# Altium project Shuttler_AMC.PrjPcb (part 9 of 20)

## Sheet I2C_MUX.SchDoc: =ProjectName
size 420 x 297 mm; Author: T.P.; CompanyName: WUT; DrawnBy: T.P.; Organization: WUT ISE; Address1: Warsaw Univeristy of Technology; Address2: Nowowiejska 15/19; DocumentNumber: 34; Revision: 0.9; SheetNumber: 34; SheetTotal: 36; EDA_Number: ARTIQ; Projet: ARTIQ/SINARA; ModifiedBy: -; CreateDate: XX/XX/XXXX; CheckedDate: -; Title2: I2C_MUX.SchDoc; DivGrp: ISE; Designer: G.K. and T.P.; ModifiedDate: -; ProjectName: ADC/DAC MEZZANINE
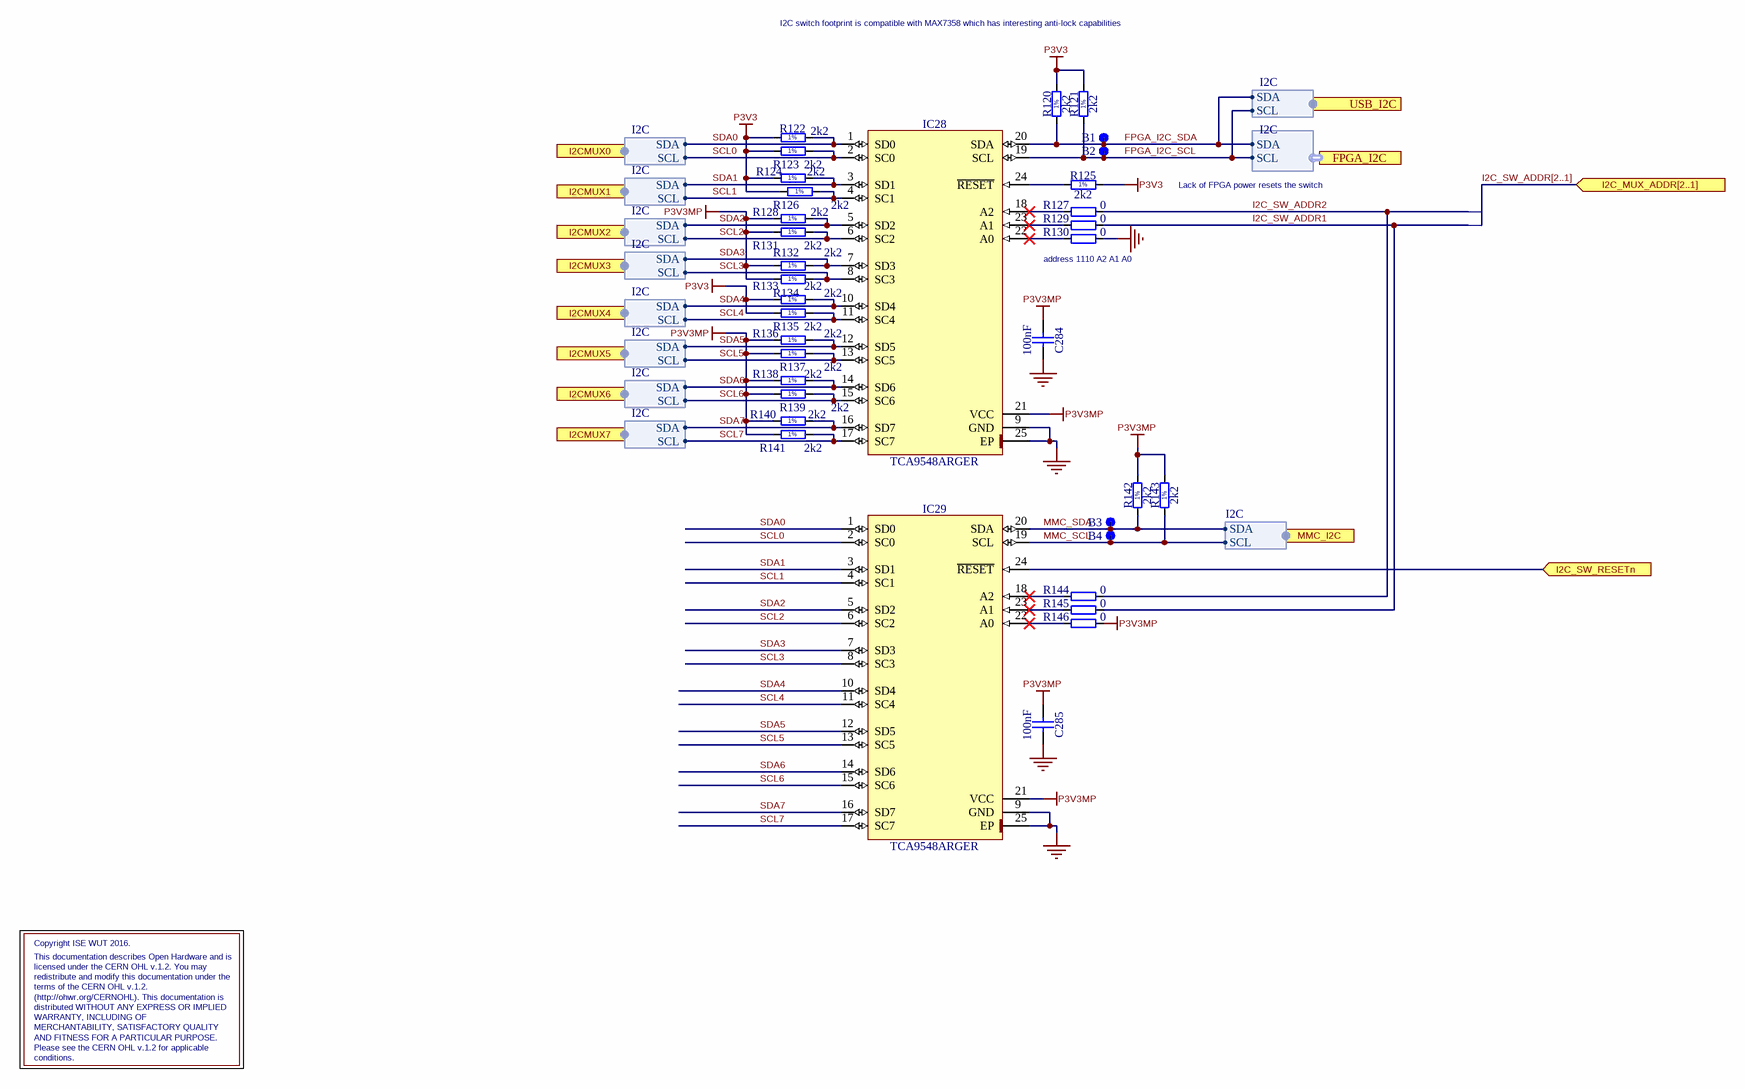
[diagram p16: I2C_MUX.SchDoc]

### Parts
B1  SMD Pad  [C100]  (value not drawn)
B2  SMD Pad  [C100]  (value not drawn)
B3  SMD Pad  [C100]  (value not drawn)
B4  SMD Pad  [C100]  (value not drawn)
C284  100nF  [CAPC0603X33N]
C285  100nF  [CAPC0603X33N]
IC28  TCA9548ARGER  [QFN50P400X400X100-25N-S220]
IC29  TCA9548ARGER  [QFN50P400X400X100-25N-S220]
R120  2k2  [RESC1005X40N]
R121  2k2  [RESC1005X40N]
R122  2k2  [RESC1005X40N]
R123  2k2  [RESC1005X40N]
R124  2k2  [RESC1005X40N]
R125  2k2  [RESC1005X40N]
R126  2k2  [RESC1005X40N]
R127  0  [RESC1005X40N]
R128  2k2  [RESC1005X40N]
R129  0  [RESC1005X40N]
R130  0  [RESC1005X40N]
R131  2k2  [RESC1005X40N]
R132  2k2  [RESC1005X40N]
R133  2k2  [RESC1005X40N]
R134  2k2  [RESC1005X40N]
R135  2k2  [RESC1005X40N]
R136  2k2  [RESC1005X40N]
R137  2k2  [RESC1005X40N]
R138  2k2  [RESC1005X40N]
R139  2k2  [RESC1005X40N]
R140  2k2  [RESC1005X40N]
R141  2k2  [RESC1005X40N]
R142  2k2  [RESC1005X40N]
R143  2k2  [RESC1005X40N]
R144  0  [RESC1005X40N]
R145  0  [RESC1005X40N]
R146  0  [RESC1005X40N]

### Ports
FPGA_I2C (harness I2C), I2C_MUX_ADDR[2..1] (in), I2C_SW_RESETn (in), I2CMUX0 (harness I2C), I2CMUX1 (harness I2C), I2CMUX2 (harness I2C), I2CMUX3 (harness I2C), I2CMUX4 (harness I2C), I2CMUX5 (harness I2C), I2CMUX6 (harness I2C), I2CMUX7 (harness I2C), MMC_I2C (harness I2C), USB_I2C (harness I2C)

### Harnesses
I2C: SCL, SDA

### Nets
GND: C284.2 C285.2 IC28.9(GND) IC28.25(EP) IC29.9(GND) IC29.25(EP) R130.1
P3V3: R120.2 R121.2 R122.1 R123.1 R124.1 R125.1 R126.1 R134.1 R135.1
P3V3MP: C284.1 C285.1 IC28.21(VCC) IC29.21(VCC) R128.1 R131.1 R132.1 R133.1 R136.1 R137.1 R138.1 R139.1 R140.1 R141.1 R142.2 R143.2 R146.1
FPGA_I2C_SCL: B2.1 IC28.19(SCL) R121.1 ; port FPGA_I2C.SCL, port USB_I2C.SCL  [project net FPGA_I2C.SCL]
FPGA_I2C_SDA: B1.1 IC28.20(SDA) R120.1 ; port FPGA_I2C.SDA, port USB_I2C.SDA  [project net FPGA_I2C.SDA]
I2C_SW_ADDR1: R129.1 R145.1  [project net I2C_MUX_ADDR1]
I2C_SW_ADDR2: R127.1 R144.1  [project net I2C_MUX_ADDR2]
I2C_SW_RESETn: IC29.24(~{RESET}) ; port I2C_SW_RESETn
MMC_SCL: B4.1 IC29.19(SCL) R143.1 ; port MMC_I2C.SCL  [project net MMC_I2C.SCL]
MMC_SDA: B3.1 IC29.20(SDA) R142.1 ; port MMC_I2C.SDA  [project net MMC_I2C.SDA]
SCL0: IC28.2(SC0) IC29.2(SC0) R123.2 ; port I2CMUX0.SCL  [project net QSFP0_I2C.SCL]
SCL1: IC28.4(SC1) IC29.4(SC1) R126.2 ; port I2CMUX1.SCL  [project net QSFP1_I2C.SCL]
SCL2: IC28.6(SC2) IC29.6(SC2) R131.2 ; port I2CMUX2.SCL  [project net DAC_I2C.SCL]
SCL3: IC28.8(SC3) IC29.8(SC3) R133.2 ; port I2CMUX3.SCL
SCL4: IC28.11(SC4) IC29.11(SC4) R135.2 ; port I2CMUX4.SCL  [project net SI5324_I2C.SCL]
SCL5: IC28.13(SC5) IC29.13(SC5) R137.2 ; port I2CMUX5.SCL  [project net PM_I2C.SCL]
SCL6: IC28.15(SC6) IC29.15(SC6) R139.2 ; port I2CMUX6.SCL  [project net SENS_I2C.SCL]
SCL7: IC28.17(SC7) IC29.17(SC7) R141.2 ; port I2CMUX7.SCL
SDA0: IC28.1(SD0) IC29.1(SD0) R122.2 ; port I2CMUX0.SDA  [project net QSFP0_I2C.SDA]
SDA1: IC28.3(SD1) IC29.3(SD1) R124.2 ; port I2CMUX1.SDA  [project net QSFP1_I2C.SDA]
SDA2: IC28.5(SD2) IC29.5(SD2) R128.2 ; port I2CMUX2.SDA  [project net DAC_I2C.SDA]
SDA3: IC28.7(SD3) IC29.7(SD3) R132.2 ; port I2CMUX3.SDA
SDA4: IC28.10(SD4) IC29.10(SD4) R134.2 ; port I2CMUX4.SDA  [project net SI5324_I2C.SDA]
SDA5: IC28.12(SD5) IC29.12(SD5) R136.2 ; port I2CMUX5.SDA  [project net PM_I2C.SDA]
SDA6: IC28.14(SD6) IC29.14(SD6) R138.2 ; port I2CMUX6.SDA  [project net SENS_I2C.SDA]
SDA7: IC28.16(SD7) IC29.16(SD7) R140.2 ; port I2CMUX7.SDA
NetIC28_18: IC28.18(A2) R127.2
NetIC28_22: IC28.22(A0) R130.2
NetIC28_23: IC28.23(A1) R129.2
NetIC28_24: IC28.24(~{RESET}) R125.2
NetIC29_18: IC29.18(A2) R144.2
NetIC29_22: IC29.22(A0) R146.2
NetIC29_23: IC29.23(A1) R145.2

### Buses and harness runs
bus I2C_SW_ADDR[2..1] = port I2C_MUX_ADDR[2..1]

### Notes on the sheet
- I2C switch footprint is compatible with MAX7358 which has interesting anti-lock capabilities
- Lack of FPGA power resets the switch
- (near R130) address 1110 A2 A1 A0
- Copyright ISE WUT 2016.
- This documentation describes Open Hardware and is
- licensed under the CERN OHL v.1.2. You may
- distributed WITHOUT ANY EXPRESS OR IMPLIED
- terms of the CERN OHL v.1.2.
- WARRANTY, INCLUDING OF
- redistribute and modify this documentation under the
- (http://ohwr.org/CERNOHL). This documentation is
- MERCHANTABILITY, SATISFACTORY QUALITY
- conditions.
- Please see the CERN OHL v.1.2 for applicable
- AND FITNESS FOR A PARTICULAR PURPOSE.
- Project/Equipment
- Document
- Designer
- Drawn by
- Check.by
- File
- Last Mod.
- Print Date
- Sheet
- Size
- A3
- of
- Rev
- (in symbol R0402_2K2_1%_0.0625W_100PPM) 1%

### Library data of the parts
B1-B4 = SMD_PAD_D1MM: Through Hole Pad; Part Description: 1mm Diameter SMD Pad; Mounted: No; Part Number: SMD_PAD_D1MM; Component Kind: Standard (No BOM); Component Type: Standard (No BOM); Pin Count: 1; Family: SMD Pad; Socket: No; SMD: No; Sense: No; Status: None; ComponentHeight: 0mm; HelpURL: Undefined; Author: CERN DEM JLC; CreateDate: 10.10.2017; LatestRevisionDate: 10.10.2017; PackageDescription: 1mm Diameter SMD Pad
C284 C285 = CC0201_100NF_6.3V_10%_X5R: as C158 on sheet Clk_recovery; Manufacturer Part Number: CC0201_100NF_6.3V_10%_X5R; Part Number: CC0201_100NF_6.3V_10%_X5R; Value: 100nF; Component Kind: Standard; Component Type: Standard; Pin Count: 2; Status: Not Recommended; Case: 0201; Mounted: Yes; Socket: No; SMD: Yes; Sense: No; Manufacturer1 Example: AVX; Manufacturer1 ComponentHeight: 0.33mm; HelpURL: \\cern.ch\dfs\Applications\Altium\Datasheets\CC0201_X5R_AVX.pdf; Author: CERN DEM JLC; CreateDate: 03.12.2007; LatestRevisionDate: 03.12.2007
IC28 IC29 = TCA9548ARGER: Low Voltage 8-Channel I2C Switch With Reset; Manufacturer: TEXAS INSTRUMENTS; PressFit: No; Bonding: No; Manufacturer Part Number: TCA9548ARGER; PackageDescription: QFN, 0.50mm Pitch, Square; 24 Pin, 4.00mm L X 4.00mm W X 1.00mm H body (w/thermal tab 2.2 X 2.2mm), IPC Medium Density; Part Description: Low Voltage 8-Channel I2C Switch With Reset; Part Number: TCA9548ARGER; Component Kind: Standard; Component Type: Standard; Device: TCA9548ARGER; Pin Count: 25; Case: QFN24; Mounted: Yes; Socket: No; SMD: Yes; Sense: No; ComponentHeight: 1mm; Author: CERN DEM JLC; HelpURL: \\cern.ch\dfs\Applications\Altium\Datasheets\TCA9548ARGER.pdf; CreateDate: 07.07.2014; LatestRevisionDate: 07.07.2014
R120-R126 R128 R131-R143 = R0402_2K2_1%_0.0625W_100PPM: Resistor - 1%; Manufacturer: GENERIC; Part Description: General Purpose Thick Film Chip Resistor; Manufacturer1 Part Number: 232270672202L; TC: ±100ppm/°C; PressFit: No; Manufacturer Part Number: R0402_2K2_1%_0.0625W_100PPM; Part Number: R0402_2K2_1%_0.0625W_100PPM; Tolerance: ±1%; Value: 2k2; Component Kind: Standard; Component Type: Standard; Pin Count: 2; Status: Not Recommended; Power: 0.0625W; Case: 0402; Mounted: Yes; Sense: No; Socket: No; SMD: Yes; Manufacturer1 Example: YAGEO PHYCOMP; Manufacturer1 ComponentHeight: 0.4mm; HelpURL: \\cern.ch\dfs\Applications\Altium\Datasheets\R0402_Phycomp_RC0402.pdf; Author: CERN DEM JLC; CreateDate: 03.12.2007; LatestRevisionDate: 17.10.2012
R127 R129 R130 R144-R146 = R0402_0R_JUMPER: as R389 on sheet Clk_recovery; Manufacturer Part Number: R0402_0R_JUMPER; Part Number: R0402_0R_JUMPER; Value: 0; Component Kind: Standard; Component Type: Standard; Pin Count: 2; Status: Not Recommended; Case: 0402; Mounted: Yes; Sense: No; Socket: No; SMD: Yes; Manufacturer1 Example: YAGEO PHYCOMP; Manufacturer1 ComponentHeight: 0.4mm; HelpURL: \\cern.ch\dfs\Applications\Altium\Datasheets\R0402_Phycomp_RC0402.pdf; Author: CERN DEM JLC; CreateDate: 03.12.2007; LatestRevisionDate: 17.10.2012

## Sheet M-LVDS_PHY.SchDoc: =ProjectName
size 420 x 297 mm; Author: T.P.; CompanyName: WUT; DrawnBy: T.P.; Organization: WUT ISE; Address1: Warsaw Univeristy of Technology; Address2: Nowowiejska 15/19; DocumentNumber: 32; Revision: 0.9; SheetNumber: 32; SheetTotal: 36; EDA_Number: ARTIQ; Projet: ARTIQ/SINARA; ModifiedBy: -; CreateDate: XX/XX/XXXX; CheckedDate: -; Title2: M-LVDS_PHY.SchDoc; DivGrp: ISE; Designer: G.K. and T.P.; ModifiedDate: -; ProjectName: ADC/DAC MEZZANINE
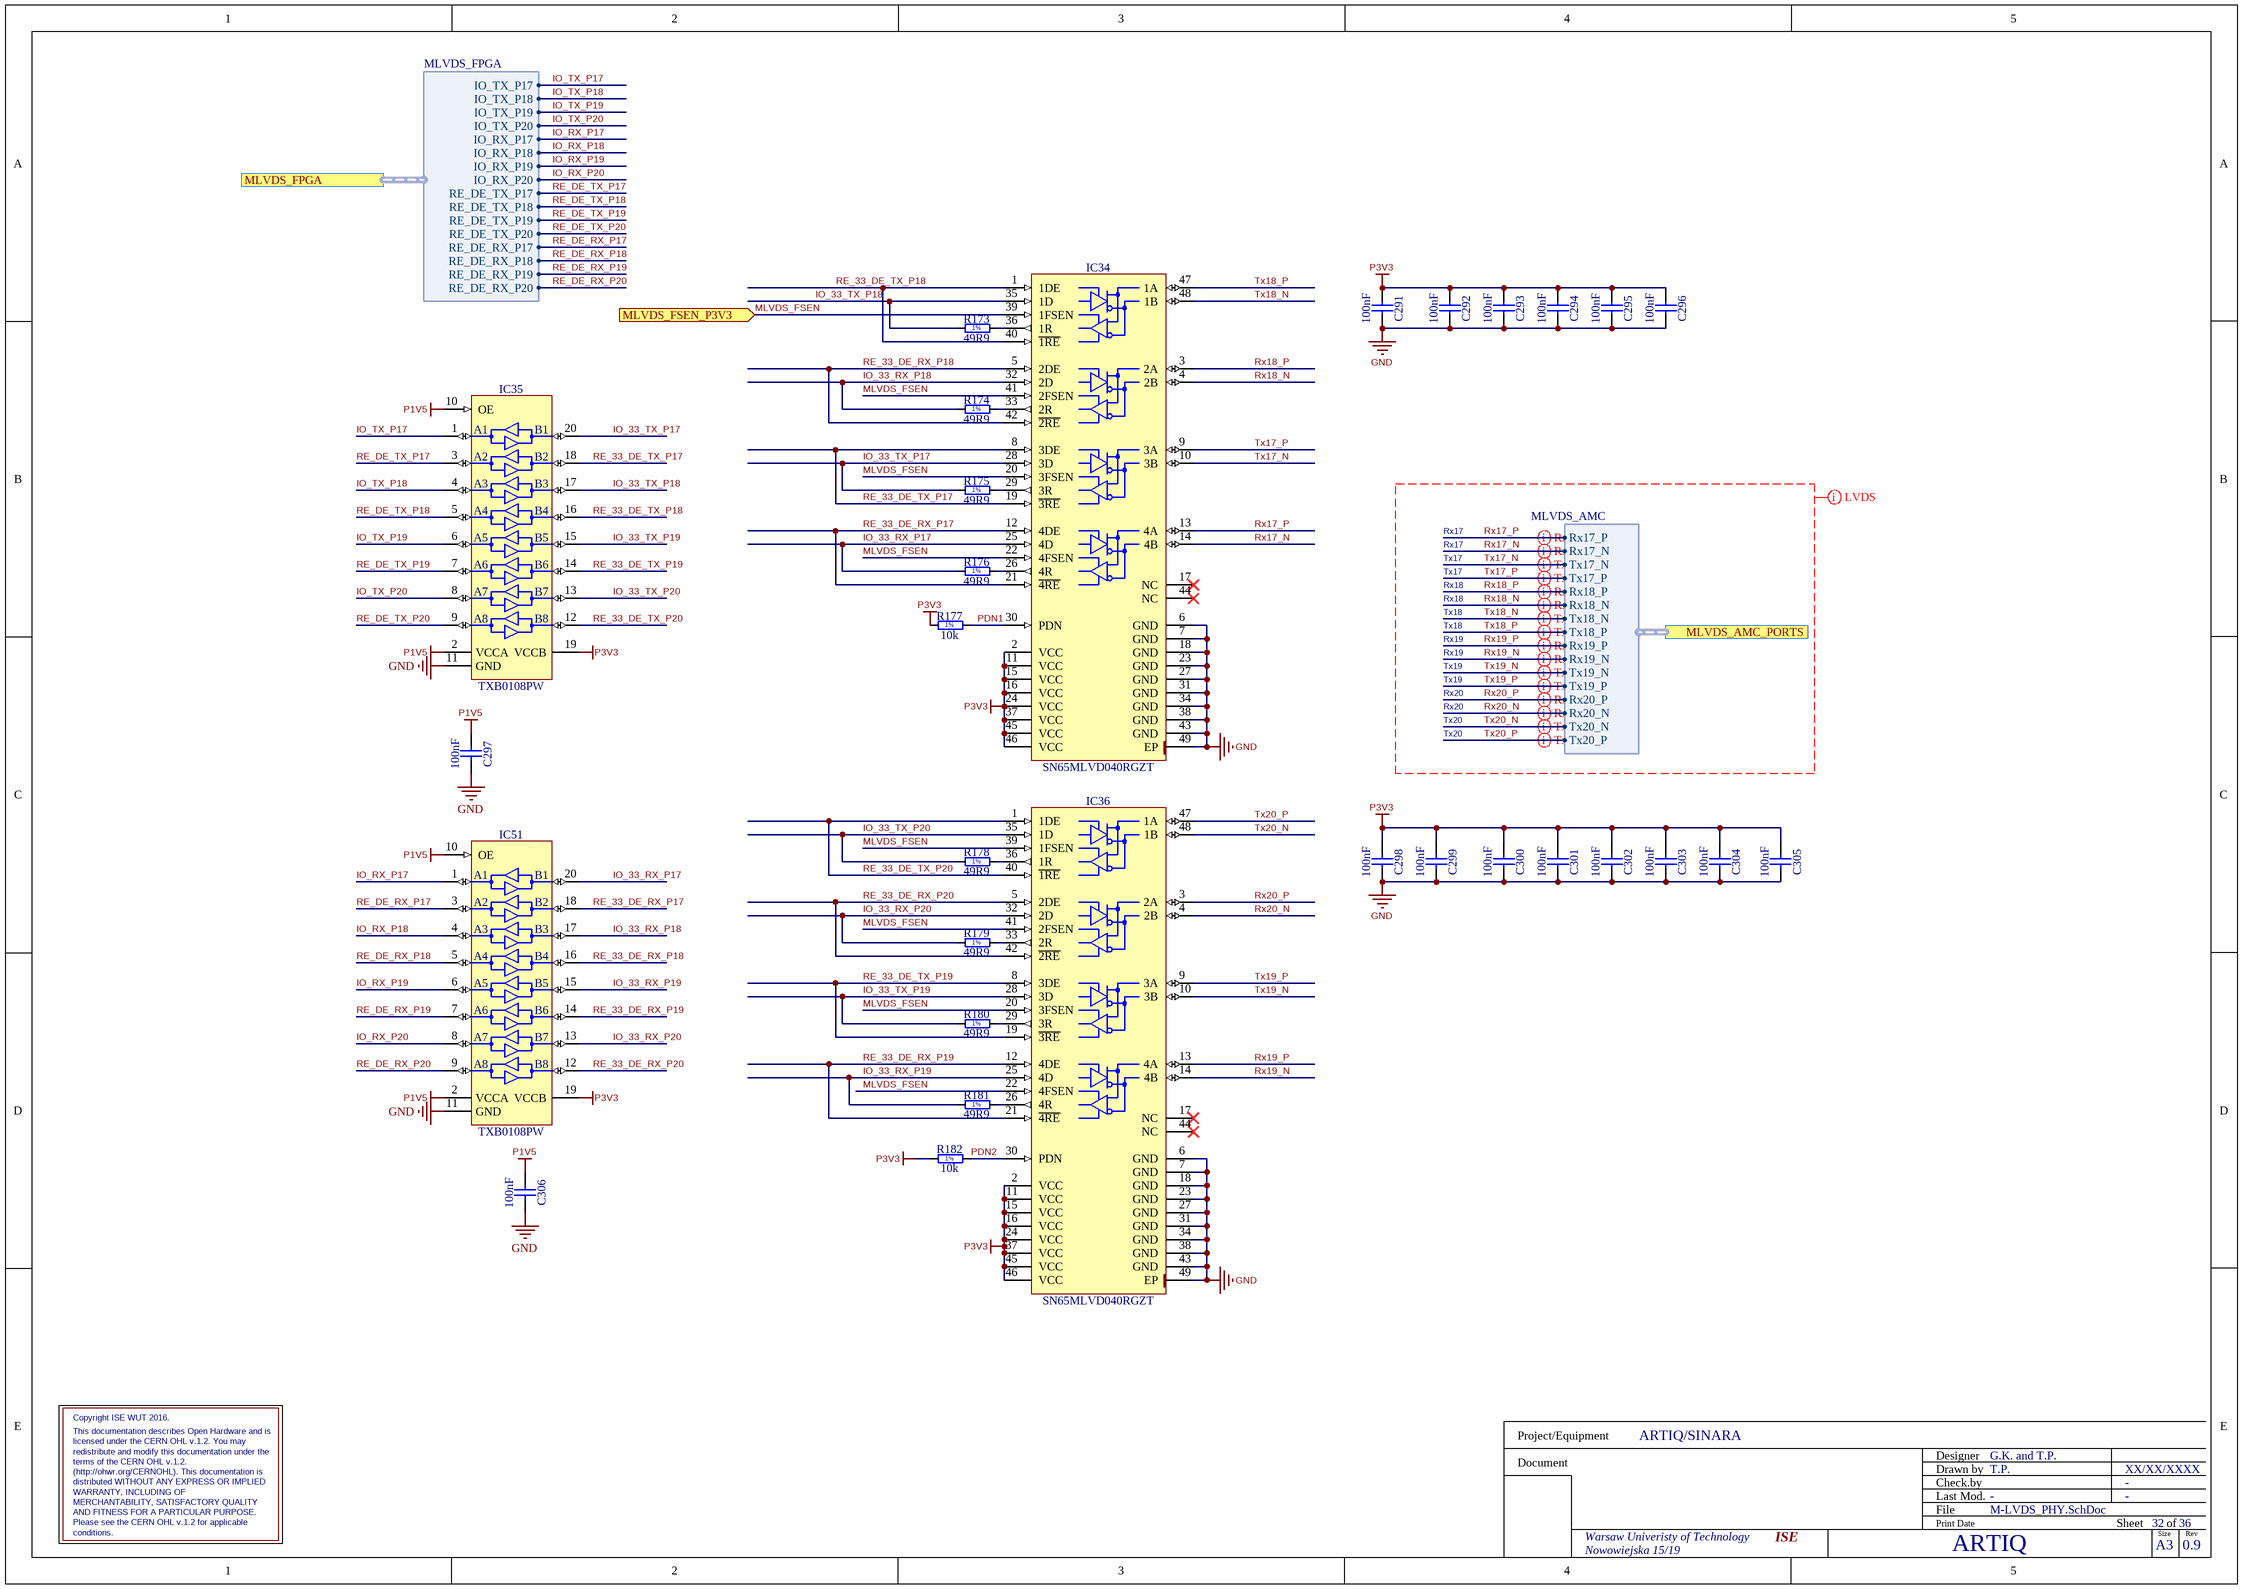
[diagram p17: M-LVDS_PHY.SchDoc]

### Parts
C291  100nF  [CAPC0603X33N]
C292  100nF  [CAPC0603X33N]
C293  100nF  [CAPC0603X33N]
C294  100nF  [CAPC0603X33N]
C295  100nF  [CAPC0603X33N]
C296  100nF  [CAPC0603X33N]
C297  100nF  [CAPC0603X33N]
C298  100nF  [CAPC0603X33N]
C299  100nF  [CAPC0603X33N]
C300  100nF  [CAPC0603X33N]
C301  100nF  [CAPC0603X33N]
C302  100nF  [CAPC0603X33N]
C303  100nF  [CAPC0603X33N]
C304  100nF  [CAPC0603X33N]
C305  100nF  [CAPC0603X33N]
C306  100nF  [CAPC0603X33N]
IC34  SN65MLVD040RGZT  [QFN50P700X700X100-49N-S420]
IC35  TXB0108PW  [SOP65P640X120-20N]
IC36  SN65MLVD040RGZT  [QFN50P700X700X100-49N-S420]
IC51  TXB0108PW  [SOP65P640X120-20N]
R173  49R9  [RESC1005X40N]
R174  49R9  [RESC1005X40N]
R175  49R9  [RESC1005X40N]
R176  49R9  [RESC1005X40N]
R177  10k  [RESC1005X40N]
R178  49R9  [RESC1005X40N]
R179  49R9  [RESC1005X40N]
R180  49R9  [RESC1005X40N]
R181  49R9  [RESC1005X40N]
R182  10k  [RESC1005X40N]

### Ports
MLVDS_AMC_PORTS (harness MLVDS_AMC), MLVDS_FPGA (harness MLVDS_FPGA), MLVDS_FSEN_P3V3 (in)

### Harnesses
MLVDS_AMC: Rx17_P, Rx17_N, Tx17_N, Tx17_P, Rx18_P, Rx18_N, Tx18_N, Tx18_P, Rx19_P, Rx19_N, Tx19_N, Tx19_P, Rx20_P, Rx20_N, Tx20_N, Tx20_P
MLVDS_FPGA: IO_TX_P17, IO_TX_P18, IO_TX_P19, IO_TX_P20, IO_RX_P17, IO_RX_P18, IO_RX_P19, IO_RX_P20, RE_DE_TX_P17, RE_DE_TX_P18, RE_DE_TX_P19, RE_DE_TX_P20, RE_DE_RX_P17, RE_DE_RX_P18, RE_DE_RX_P19, RE_DE_RX_P20

### Nets
GND: C291.2 C292.2 C293.2 C294.2 C295.2 C296.2 C297.2 C298.2 C299.2 C300.2 C301.2 C302.2 C303.2 C304.2 C305.2 C306.2 IC34.6(GND) IC34.7(GND) IC34.18(GND) IC34.23(GND) IC34.27(GND) IC34.31(GND) IC34.34(GND) IC34.38(GND) IC34.43(GND) IC34.49(EP) IC35.11(GND) IC36.6(GND) IC36.7(GND) IC36.18(GND) IC36.23(GND) IC36.27(GND) IC36.31(GND) IC36.34(GND) IC36.38(GND) IC36.43(GND) IC36.49(EP) IC51.11(GND)
P1V5: C297.1 C306.1 IC35.2(Vcca) IC35.10(OE) IC51.2(Vcca) IC51.10(OE)
P3V3: C291.1 C292.1 C293.1 C294.1 C295.1 C296.1 C298.1 C299.1 C300.1 C301.1 C302.1 C303.1 C304.1 C305.1 IC34.2(VCC) IC34.11(VCC) IC34.15(VCC) IC34.16(VCC) IC34.24(VCC) IC34.37(VCC) IC34.45(VCC) IC34.46(VCC) IC35.19(Vccb) IC36.2(VCC) IC36.11(VCC) IC36.15(VCC) IC36.16(VCC) IC36.24(VCC) IC36.37(VCC) IC36.45(VCC) IC36.46(VCC) IC51.19(Vccb) R177.1 R182.1
IO_33_RX_P17: IC34.25(4D) IC51.20(B1) R176.1
IO_33_RX_P18: IC34.32(2D) IC51.17(B3) R174.1
IO_33_RX_P19: IC36.25(4D) IC51.15(B5) R181.1
IO_33_RX_P20: IC36.32(2D) IC51.13(B7) R179.1
IO_33_TX_P17: IC34.28(3D) IC35.20(B1) R175.1
IO_33_TX_P18: IC34.35(1D) IC35.17(B3) R173.1
IO_33_TX_P19: IC35.15(B5) IC36.28(3D) R180.1
IO_33_TX_P20: IC35.13(B7) IC36.35(1D) R178.1
IO_RX_P17: IC51.1(A1) ; port MLVDS_FPGA.IO_RX_P17
IO_RX_P18: IC51.4(A3) ; port MLVDS_FPGA.IO_RX_P18
IO_RX_P19: IC51.6(A5) ; port MLVDS_FPGA.IO_RX_P19
IO_RX_P20: IC51.8(A7) ; port MLVDS_FPGA.IO_RX_P20
IO_TX_P17: IC35.1(A1) ; port MLVDS_FPGA.IO_TX_P17
IO_TX_P18: IC35.4(A3) ; port MLVDS_FPGA.IO_TX_P18
IO_TX_P19: IC35.6(A5) ; port MLVDS_FPGA.IO_TX_P19
IO_TX_P20: IC35.8(A7) ; port MLVDS_FPGA.IO_TX_P20
MLVDS_FSEN: IC34.20(3FSEN) IC34.22(4FSEN) IC34.39(1FSEN) IC34.41(2FSEN) IC36.20(3FSEN) IC36.22(4FSEN) IC36.39(1FSEN) IC36.41(2FSEN) ; port MLVDS_FSEN_P3V3
PDN1: IC34.30(PDN) R177.2
PDN2: IC36.30(PDN) R182.2
RE_33_DE_RX_P17: IC34.12(4DE) IC34.21(~{4RE}) IC51.18(B2)
RE_33_DE_RX_P18: IC34.5(2DE) IC34.42(~{2RE}) IC51.16(B4)
RE_33_DE_RX_P19: IC36.12(4DE) IC36.21(~{4RE}) IC51.14(B6)
RE_33_DE_RX_P20: IC36.5(2DE) IC36.42(~{2RE}) IC51.12(B8)
RE_33_DE_TX_P17: IC34.8(3DE) IC34.19(~{3RE}) IC35.18(B2)
RE_33_DE_TX_P18: IC34.1(1DE) IC34.40(~{1RE}) IC35.16(B4)
RE_33_DE_TX_P19: IC35.14(B6) IC36.8(3DE) IC36.19(~{3RE})
RE_33_DE_TX_P20: IC35.12(B8) IC36.1(1DE) IC36.40(~{1RE})
RE_DE_RX_P17: IC51.3(A2) ; port MLVDS_FPGA.RE_DE_RX_P17
RE_DE_RX_P18: IC51.5(A4) ; port MLVDS_FPGA.RE_DE_RX_P18
RE_DE_RX_P19: IC51.7(A6) ; port MLVDS_FPGA.RE_DE_RX_P19
RE_DE_RX_P20: IC51.9(A8) ; port MLVDS_FPGA.RE_DE_RX_P20
RE_DE_TX_P17: IC35.3(A2) ; port MLVDS_FPGA.RE_DE_TX_P17
RE_DE_TX_P18: IC35.5(A4) ; port MLVDS_FPGA.RE_DE_TX_P18
RE_DE_TX_P19: IC35.7(A6) ; port MLVDS_FPGA.RE_DE_TX_P19
RE_DE_TX_P20: IC35.9(A8) ; port MLVDS_FPGA.RE_DE_TX_P20
Rx17_N: IC34.14(4B) ; port MLVDS_AMC_PORTS.Rx17_N  [project net MLVDS_AMC_PORTS.Rx17_N]
Rx17_P: IC34.13(4A) ; port MLVDS_AMC_PORTS.Rx17_P  [project net MLVDS_AMC_PORTS.Rx17_P]
Rx18_N: IC34.4(2B) ; port MLVDS_AMC_PORTS.Rx18_N  [project net MLVDS_AMC_PORTS.Rx18_N]
Rx18_P: IC34.3(2A) ; port MLVDS_AMC_PORTS.Rx18_P  [project net MLVDS_AMC_PORTS.Rx18_P]
Rx19_N: IC36.14(4B) ; port MLVDS_AMC_PORTS.Rx19_N  [project net MLVDS_AMC_PORTS.Rx19_N]
Rx19_P: IC36.13(4A) ; port MLVDS_AMC_PORTS.Rx19_P  [project net MLVDS_AMC_PORTS.Rx19_P]
Rx20_N: IC36.4(2B) ; port MLVDS_AMC_PORTS.Rx20_N  [project net MLVDS_AMC_PORTS.Rx20_N]
Rx20_P: IC36.3(2A) ; port MLVDS_AMC_PORTS.Rx20_P  [project net MLVDS_AMC_PORTS.Rx20_P]
Tx17_N: IC34.10(3B) ; port MLVDS_AMC_PORTS.Tx17_N  [project net MLVDS_AMC_PORTS.Tx17_N]
Tx17_P: IC34.9(3A) ; port MLVDS_AMC_PORTS.Tx17_P  [project net MLVDS_AMC_PORTS.Tx17_P]
Tx18_N: IC34.48(1B) ; port MLVDS_AMC_PORTS.Tx18_N  [project net MLVDS_AMC_PORTS.Tx18_N]
Tx18_P: IC34.47(1A) ; port MLVDS_AMC_PORTS.Tx18_P  [project net MLVDS_AMC_PORTS.Tx18_P]
Tx19_N: IC36.10(3B) ; port MLVDS_AMC_PORTS.Tx19_N  [project net MLVDS_AMC_PORTS.Tx19_N]
Tx19_P: IC36.9(3A) ; port MLVDS_AMC_PORTS.Tx19_P  [project net MLVDS_AMC_PORTS.Tx19_P]
Tx20_N: IC36.48(1B) ; port MLVDS_AMC_PORTS.Tx20_N  [project net MLVDS_AMC_PORTS.Tx20_N]
Tx20_P: IC36.47(1A) ; port MLVDS_AMC_PORTS.Tx20_P  [project net MLVDS_AMC_PORTS.Tx20_P]
NetIC34_26: IC34.26(4R) R176.2
NetIC34_29: IC34.29(3R) R175.2
NetIC34_33: IC34.33(2R) R174.2
NetIC34_36: IC34.36(1R) R173.2
NetIC36_26: IC36.26(4R) R181.2
NetIC36_29: IC36.29(3R) R180.2
NetIC36_33: IC36.33(2R) R179.2
NetIC36_36: IC36.36(1R) R178.2

Not connected (* = marked no-connect by the designer): IC34 17(NC)* 44(NC)*; IC36 17(NC)* 44(NC)*

### Layout directives
differential pair: MLVDS_AMC_PORTS.Rx17_N, MLVDS_AMC_PORTS.Rx17_P, MLVDS_AMC_PORTS.Rx18_N, MLVDS_AMC_PORTS.Rx18_P, MLVDS_AMC_PORTS.Rx19_N, MLVDS_AMC_PORTS.Rx19_P, MLVDS_AMC_PORTS.Rx20_N, MLVDS_AMC_PORTS.Rx20_P, MLVDS_AMC_PORTS.Tx17_N, MLVDS_AMC_PORTS.Tx17_P, MLVDS_AMC_PORTS.Tx18_N, MLVDS_AMC_PORTS.Tx18_P, MLVDS_AMC_PORTS.Tx19_N, MLVDS_AMC_PORTS.Tx19_P, MLVDS_AMC_PORTS.Tx20_N, MLVDS_AMC_PORTS.Tx20_P
mark named LVDS: Rx17_N, Rx17_P, Rx18_N, Rx18_P, Rx19_N, Rx19_P, Rx20_N, Rx20_P, Tx17_N, Tx17_P, Tx18_N, Tx18_P, Tx19_N, Tx19_P, Tx20_N, Tx20_P

### Notes on the sheet
- Rx17
- Tx17
- Rx18
- Tx19
- Tx18
- Rx19
- Tx20
- Rx20
- Copyright ISE WUT 2016.
- distributed WITHOUT ANY EXPRESS OR IMPLIED
- (http://ohwr.org/CERNOHL). This documentation is
- redistribute and modify this documentation under the
- terms of the CERN OHL v.1.2.
- licensed under the CERN OHL v.1.2. You may
- This documentation describes Open Hardware and is
- AND FITNESS FOR A PARTICULAR PURPOSE.
- MERCHANTABILITY, SATISFACTORY QUALITY
- Please see the CERN OHL v.1.2 for applicable
- conditions.
- WARRANTY, INCLUDING OF
- Project/Equipment
- Document
- Designer
- Drawn by
- Check.by
- File
- Last Mod.
- Print Date
- Sheet
- Size
- A3
- of
- Rev
- (in symbol R0402_10K_1%_0.0625W_100PPM) 1%
- (in symbol R0402_49R9_1%_0.0625W_100PPM) 1%
- (in symbol TXB0108PW) VCCA; VCCB

### Library data of the parts
C291-C306 = CC0201_100NF_6.3V_10%_X5R: Non-polarised capacitor; Manufacturer: GENERIC; Manufacturer1 Part Number: 02016D104KAT2A; Part Description: SMD Multilayer Chip Ceramic Capacitor; TC: X5R; Tolerance: ±10%; Voltage: 6.3V; Author: CERN DEM JLC; Case: 0201; Component Kind: Standard; Component Type: Standard; CreateDate: 03.12.2007; HelpURL: \\cern.ch\dfs\Applications\Altium\Datasheets\CC0201_X5R_AVX.pdf; LatestRevisionDate: 03.12.2007; Manufacturer Part Number: CC0201_100NF_6.3V_10%_X5R; Manufacturer1 ComponentHeight: 0.33mm; Manufacturer1 Example: AVX; Mounted: Yes; Part Number: CC0201_100NF_6.3V_10%_X5R; Pin Count: 2; SMD: Yes; Socket: No; Status: Not Recommended; Value: 100nF; Sense: No
IC34 IC36 = SN65MLVD040RGZT: 4-Channel Half-Duplex M-LVDS Line Transceiver; Manufacturer: TEXAS INSTRUMENTS; PressFit: No; Bonding: No; Part Number: SN65MLVD040RGZT; Component Kind: Standard; Component Type: Standard; Device: SN65MLVD040RGZT; PackageDescription: QFN, 0.50mm Pitch, Square; 48 Pin, 7.00mm L X 7.00mm W X 1mm H body (W/Thermal Tab 4.2mm X 4.2mm), IPC Medium Density; Part Description: 4-Channel Half-Duplex M-LVDS Line Transceiver; Manufacturer Part Number: SN65MLVD040RGZT; Pin Count: 49; Case: QFN48; Mounted: Yes; Socket: No; SMD: Yes; Sense: No; ComponentHeight: 1mm; Author: CERN DEM JLC; HelpURL: \\cern.ch\dfs\Applications\Altium\Datasheets\SN65MLVD040RGZT.pdf; CreateDate: 17.03.2011; LatestRevisionDate: 17.03.2011
IC35 IC51 = TXB0108PW: 8-Bit Bidirectional Voltage-Level Translator with Automatic Direction Sensing and ±15kV ESD Protection; Manufacturer: TEXAS INSTRUMENTS; PressFit: No; Bonding: No; Part Number: TXB0108PW; Component Kind: Standard; Component Type: Standard; Device: TXB0108PW; PackageDescription: SOP, 20-Leads, Body 6.5x4.4mm, Pitch 0.65mm, IPC Medium Density; Part Description: 8-Bit Bidirectional Voltage-Level Translator with Automatic Direction Sensing and ±15kV ESD Protection; Manufacturer Part Number: TXB0108PW; Pin Count: 20; Case: TSSOP20; Mounted: Yes; Socket: No; SMD: Yes; Sense: No; ComponentHeight: 1.2mm; Author: CERN DEM MR; HelpURL: \\cern.ch\dfs\Applications\Altium\Datasheets\TXB0108PW.pdf; CreateDate: 01.04.2016; LatestRevisionDate: 01.04.2016
R173-R176 R178-R181 = R0402_49R9_1%_0.0625W_100PPM: Resistor - 1%; Manufacturer: GENERIC; Manufacturer1 Part Number: 232270674999L or RC0402FR-0749R9L; Part Description: General Purpose Thick Film Chip Resistor; TC: ±100ppm/°C; PressFit: No; Author: CERN DEM JLC; Case: 0402; Component Kind: Standard; Component Type: Standard; CreateDate: 24.10.2012; HelpURL: \\cern.ch\dfs\Applications\Altium\Datasheets\R0402_Phycomp_RC0402.pdf; LatestRevisionDate: 24.10.2012; Manufacturer Part Number: R0402_49R9_1%_0.0625W_100PPM; Manufacturer1 ComponentHeight: 0.4mm; Manufacturer1 Example: YAGEO PHYCOMP; Mounted: Yes; Part Number: R0402_49R9_1%_0.0625W_100PPM; Pin Count: 2; Power: 0.0625W; SMD: Yes; Socket: No; Status: Not Recommended; Tolerance: ±1%; Value: 49R9; Sense: No
R177 R182 = R0402_10K_1%_0.0625W_100PPM: Resistor - 1%; Manufacturer: GENERIC; Manufacturer1 Part Number: 232270671003L; Part Description: General Purpose Thick Film Chip Resistor; TC: ±100ppm/°C; PressFit: No; Author: CERN DEM JLC; Case: 0402; Component Kind: Standard; Component Type: Standard; CreateDate: 03.12.2007; HelpURL: \\cern.ch\dfs\Applications\Altium\Datasheets\R0402_Phycomp_RC0402.pdf; LatestRevisionDate: 17.10.2012; Manufacturer Part Number: R0402_10K_1%_0.0625W_100PPM; Manufacturer1 ComponentHeight: 0.4mm; Manufacturer1 Example: YAGEO PHYCOMP; Mounted: Yes; Part Number: R0402_10K_1%_0.0625W_100PPM; Pin Count: 2; Power: 0.0625W; SMD: Yes; Socket: No; Status: Not Recommended; Tolerance: ±1%; Value: 10k; Sense: No

## Sheet Thermometers.SchDoc: =ProjectName
size 420 x 297 mm; Author: T.P.; CompanyName: WUT; DrawnBy: T.P.; Organization: WUT ISE; Address1: Warsaw Univeristy of Technology; Address2: Nowowiejska 15/19; DocumentNumber: 22; Revision: 0.9; SheetNumber: 22; SheetTotal: 36; EDA_Number: ARTIQ; Projet: ARTIQ/SINARA; ModifiedBy: -; CreateDate: XX/XX/XXXX; CheckedDate: -; Title2: Thermometers.SchDoc; DivGrp: ISE; Designer: G.K. and T.P.; ModifiedDate: -; ProjectName: ADC/DAC MEZZANINE
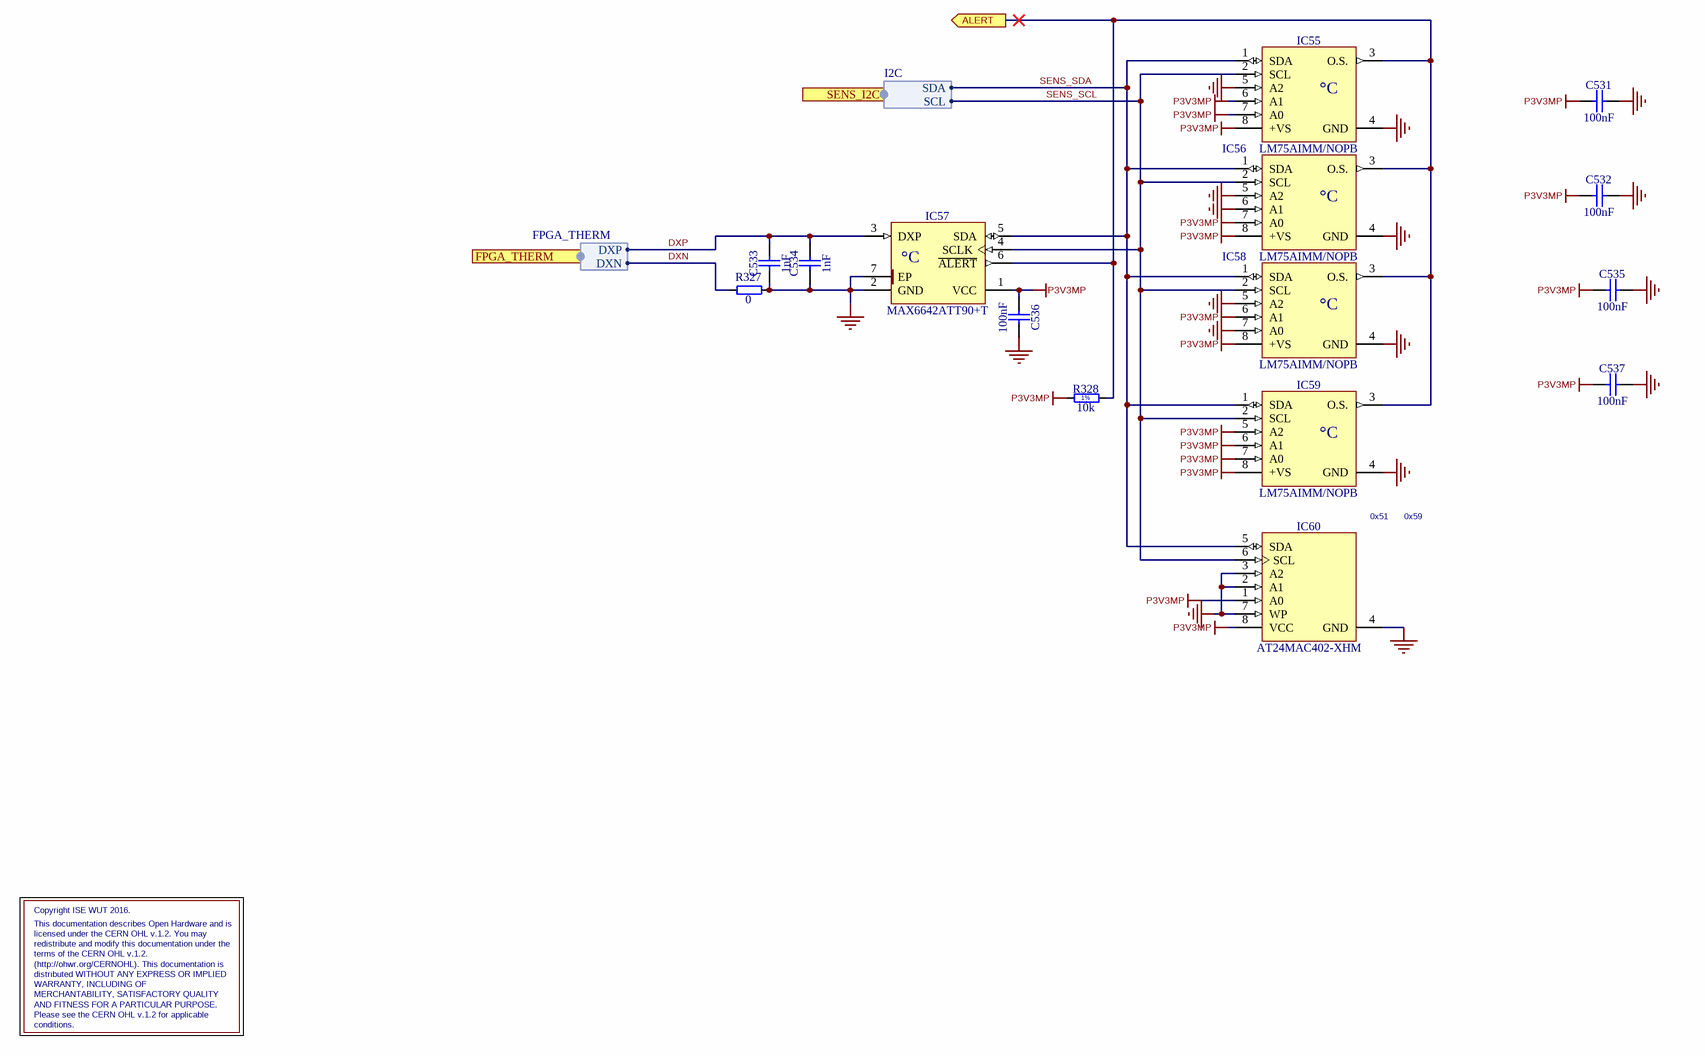
[diagram p18: Thermometers.SchDoc]

### Parts
C531  100nF  [CAPC0603X33N]
C532  100nF  [CAPC0603X33N]
C533  1nF  [CAPC1005X55N]
C534  1nF  [CAPC1005X55N]
C535  100nF  [CAPC0603X33N]
C536  100nF  [CAPC0603X33N]
C537  100nF  [CAPC0603X33N]
IC55  LM75AIMM/NOPB  [SOP65P490X109-8N]
IC56  LM75AIMM/NOPB  [SOP65P490X109-8N]
IC57  MAX6642ATT90+T  [SON95P300X300X80-7N-R160X240]
IC58  LM75AIMM/NOPB  [SOP65P490X109-8N]
IC59  LM75AIMM/NOPB  [SOP65P490X109-8N]
IC60  AT24MAC402-XHM  [SOP65P640X120-8N]
R327  0  [RESC1005X40N]
R328  10k  [RESC1005X40N]

### Ports
ALERT (out), FPGA_THERM (harness FPGA_THERM), SENS_I2C (harness I2C)

### Harnesses
FPGA_THERM: DXN, DXP
I2C: SCL, SDA

### Nets
GND: C531.2 C532.2 C533.1 C534.1 C535.2 C536.1 C537.2 IC55.4(GND) IC55.5(A2) IC56.4(GND) IC56.5(A2) IC56.6(A1) IC57.2(GND) IC57.7(EP) IC58.4(GND) IC58.5(A2) IC58.7(A0) IC59.4(GND) IC60.2(A1) IC60.3(A2) IC60.4(GND) IC60.7(WP) R327.2
P3V3MP: C531.1 C532.1 C535.1 C536.2 C537.1 IC55.6(A1) IC55.7(A0) IC55.8(+VS) IC56.7(A0) IC56.8(+VS) IC57.1(VCC) IC58.6(A1) IC58.8(+VS) IC59.5(A2) IC59.6(A1) IC59.7(A0) IC59.8(+VS) IC60.1(A0) IC60.8(VCC) R328.1
DXN: R327.1 ; port FPGA_THERM.DXN  [project net FPGA_THERM.DXN]
DXP: C533.2 C534.2 IC57.3(DXP) ; port FPGA_THERM.DXP  [project net FPGA_THERM.DXP]
OVERTEMPn: IC55.3(O.S.) IC56.3(O.S.) IC57.6(~{ALERT}) IC58.3(O.S.) IC59.3(O.S.) R328.2 ; port ALERT
SENS_SCL: IC55.2(SCL) IC56.2(SCL) IC57.4(SCLK) IC58.2(SCL) IC59.2(SCL) IC60.6(SCL) ; port SENS_I2C.SCL  [project net SENS_I2C.SCL]
SENS_SDA: IC55.1(SDA) IC56.1(SDA) IC57.5(SDA) IC58.1(SDA) IC59.1(SDA) IC60.5(SDA) ; port SENS_I2C.SDA  [project net SENS_I2C.SDA]

### Notes on the sheet
- 0x51
- 0x59
- Copyright ISE WUT 2016.
- licensed under the CERN OHL v.1.2. You may
- distributed WITHOUT ANY EXPRESS OR IMPLIED
- redistribute and modify this documentation under the
- (http://ohwr.org/CERNOHL). This documentation is
- This documentation describes Open Hardware and is
- terms of the CERN OHL v.1.2.
- WARRANTY, INCLUDING OF
- conditions.
- AND FITNESS FOR A PARTICULAR PURPOSE.
- Please see the CERN OHL v.1.2 for applicable
- MERCHANTABILITY, SATISFACTORY QUALITY
- Project/Equipment
- Document
- Designer
- Drawn by
- Check.by
- File
- Last Mod.
- Print Date
- Sheet
- Size
- A3
- of
- Rev
- (in symbol LM75AIMM/NOPB) °C
- (in symbol MAX6642ATT90+T) °C
- (in symbol R0402_10K_1%_0.0625W_100PPM) 1%

### Library data of the parts
C531 C532 C535-C537 = CC0201_100NF_6.3V_10%_X5R: as C158 on sheet Clk_recovery; Manufacturer Part Number: CC0201_100NF_6.3V_10%_X5R; Part Number: CC0201_100NF_6.3V_10%_X5R; Value: 100nF; Component Kind: Standard; Component Type: Standard; Pin Count: 2; Status: Not Recommended; Case: 0201; Mounted: Yes; Socket: No; SMD: Yes; Sense: No; Manufacturer1 Example: AVX; Manufacturer1 ComponentHeight: 0.33mm; HelpURL: \\cern.ch\dfs\Applications\Altium\Datasheets\CC0201_X5R_AVX.pdf; Author: CERN DEM JLC; CreateDate: 03.12.2007; LatestRevisionDate: 03.12.2007
C533 C534 = CC0402_1NF_50V_10%_X7R: Non-polarised capacitor; Manufacturer: GENERIC; Part Description: SMD Multilayer Chip Ceramic Capacitor; Manufacturer1 Part Number: 223858715623; Tolerance: ±10%; Voltage: 50V; TC: X7R; Manufacturer Part Number: CC0402_1NF_50V_10%_X7R; Part Number: CC0402_1NF_50V_10%_X7R; Value: 1nF; Component Kind: Standard; Component Type: Standard; Pin Count: 2; Status: Not Recommended; Case: 0402; Mounted: Yes; Socket: No; SMD: Yes; Sense: No; Manufacturer1 Example: PHYCOMP; Manufacturer1 ComponentHeight: 0.55mm; HelpURL: \\cern.ch\dfs\Applications\Altium\Datasheets\CC0402_X7R_PHYCOMP.pdf; Author: CERN DEM JLC; CreateDate: 03.12.2007; LatestRevisionDate: 03.12.2007
IC55 IC56 IC58 IC59 = LM75AIMM/NOPB: Digital Temperature Sensor and Thermal Watchdog with Two-Wire Interface; Manufacturer: TEXAS INSTRUMENTS; Part Description: -25° to +100°C ±2°C Digital Temperature Sensor and Thermal Watchdog with Two-Wire Interface; PressFit: No; Bonding: No; Manufacturer Part Number: LM75AIMM/NOPB; PackageDescription: SOP, 0.65mm pitch; 8 pin,3.00mm W X 3.00mm L X 1.09mm H bodyI, PC Medium Density; Part Number: LM75AIMM/NOPB; Component Kind: Standard; Component Type: Standard; Device: LM75AIMM/NOPB; Pin Count: 8; Case: SSOP8; Mounted: Yes; Socket: No; SMD: Yes; Sense: No; ComponentHeight: 1.09mm; HelpURL: \\cern.ch\dfs\Applications\Altium\Datasheets\LM75AIMM-NOPB.pdf; Author: CERN DEM JLC; CreateDate: 15.10.2012; LatestRevisionDate: 15.10.2012
IC57 = MAX6642ATT90+T: ±1°C, SMBus-Compatible Remote/Local Temperature Sensor with Overtemperature Alarm; Manufacturer: MAXIM; Part Description: 0°C to +125°C, ±1°C, SMBus-Compatible Remote/Local Temperature Sensor with Overtemperature Alarm (Address 1001 000); PressFit: No; Bonding: No; Manufacturer Part Number: MAX6642ATT90+T; PackageDescription: SON, 0.95mm Pitch; 6 Pin, 3.00mm W X 3mm L X 0.80mm H body (w/Thermal Tab 1.6mm x 2.4mm); Part Number: MAX6642ATT90+T; Component Kind: Standard; Component Type: Standard; Device: MAX6642ATT90+T; Pin Count: 7; Case: SON6; Mounted: Yes; Socket: No; SMD: Yes; Sense: No; ComponentHeight: 0.8mm; HelpURL: \\cern.ch\dfs\Applications\Altium\Datasheets\MAX6642ATT90+T.pdf; Author: CERN DEM JLC; CreateDate: 26.11.2013; LatestRevisionDate: 26.11.2013
IC60 = AT24MAC402-XHM: 1.7V to 5.5V, I2C-Compatible (2-wire) 2-Kbit (256 x 8) Serial EEPROM; Manufacturer: ATMEL; Part Description: 1.7V to 5.5V, I2C-Compatible (2-wire) 2-Kbit (256 x 8) Serial EEPROM with a EUI-48 Address; PressFit: No; Bonding: No; Footprint: SOP65X640X120-8N; Manufacturer Part Number: AT24MAC402-XHM; PackageDescription: SOP, 0.65mm pitch; 8 pin, 4.40mm W X 3.00mm L X 1.20mm H body, IPC Medium Density; Part Number: AT24MAC402-XHM; Component Kind: Standard; Component Type: Standard; Device: AT24MAC402-XHM; Pin Count: 8; Case: TSSOP8; Mounted: Yes; Socket: No; SMD: Yes; Sense: No; ComponentHeight: 1.2mm; HelpURL: \\cern.ch\dfs\Applications\Altium\Datasheets\AT24MAC402-XHM.pdf; Author: CERN DEM MR; CreateDate: 09.03.2016; LatestRevisionDate: 09.11.2016
R327 = R0402_0R_JUMPER: as R389 on sheet Clk_recovery; Manufacturer Part Number: R0402_0R_JUMPER; Part Number: R0402_0R_JUMPER; Value: 0; Component Kind: Standard; Component Type: Standard; Pin Count: 2; Status: Not Recommended; Case: 0402; Mounted: Yes; Sense: No; Socket: No; SMD: Yes; Manufacturer1 Example: YAGEO PHYCOMP; Manufacturer1 ComponentHeight: 0.4mm; HelpURL: \\cern.ch\dfs\Applications\Altium\Datasheets\R0402_Phycomp_RC0402.pdf; Author: CERN DEM JLC; CreateDate: 03.12.2007; LatestRevisionDate: 17.10.2012
R328 = R0402_10K_1%_0.0625W_100PPM: Resistor - 1%; Manufacturer: GENERIC; Part Description: General Purpose Thick Film Chip Resistor; Manufacturer1 Part Number: 232270671003L; TC: ±100ppm/°C; PressFit: No; Manufacturer Part Number: R0402_10K_1%_0.0625W_100PPM; Part Number: R0402_10K_1%_0.0625W_100PPM; Tolerance: ±1%; Value: 10k; Component Kind: Standard; Component Type: Standard; Pin Count: 2; Status: Not Recommended; Power: 0.0625W; Case: 0402; Mounted: Yes; Sense: No; Socket: No; SMD: Yes; Manufacturer1 Example: YAGEO PHYCOMP; Manufacturer1 ComponentHeight: 0.4mm; HelpURL: \\cern.ch\dfs\Applications\Altium\Datasheets\R0402_Phycomp_RC0402.pdf; Author: CERN DEM JLC; CreateDate: 03.12.2007; LatestRevisionDate: 17.10.2012